# EAGLE design MODUL_LCD_V100 (EAGLE 6.4)
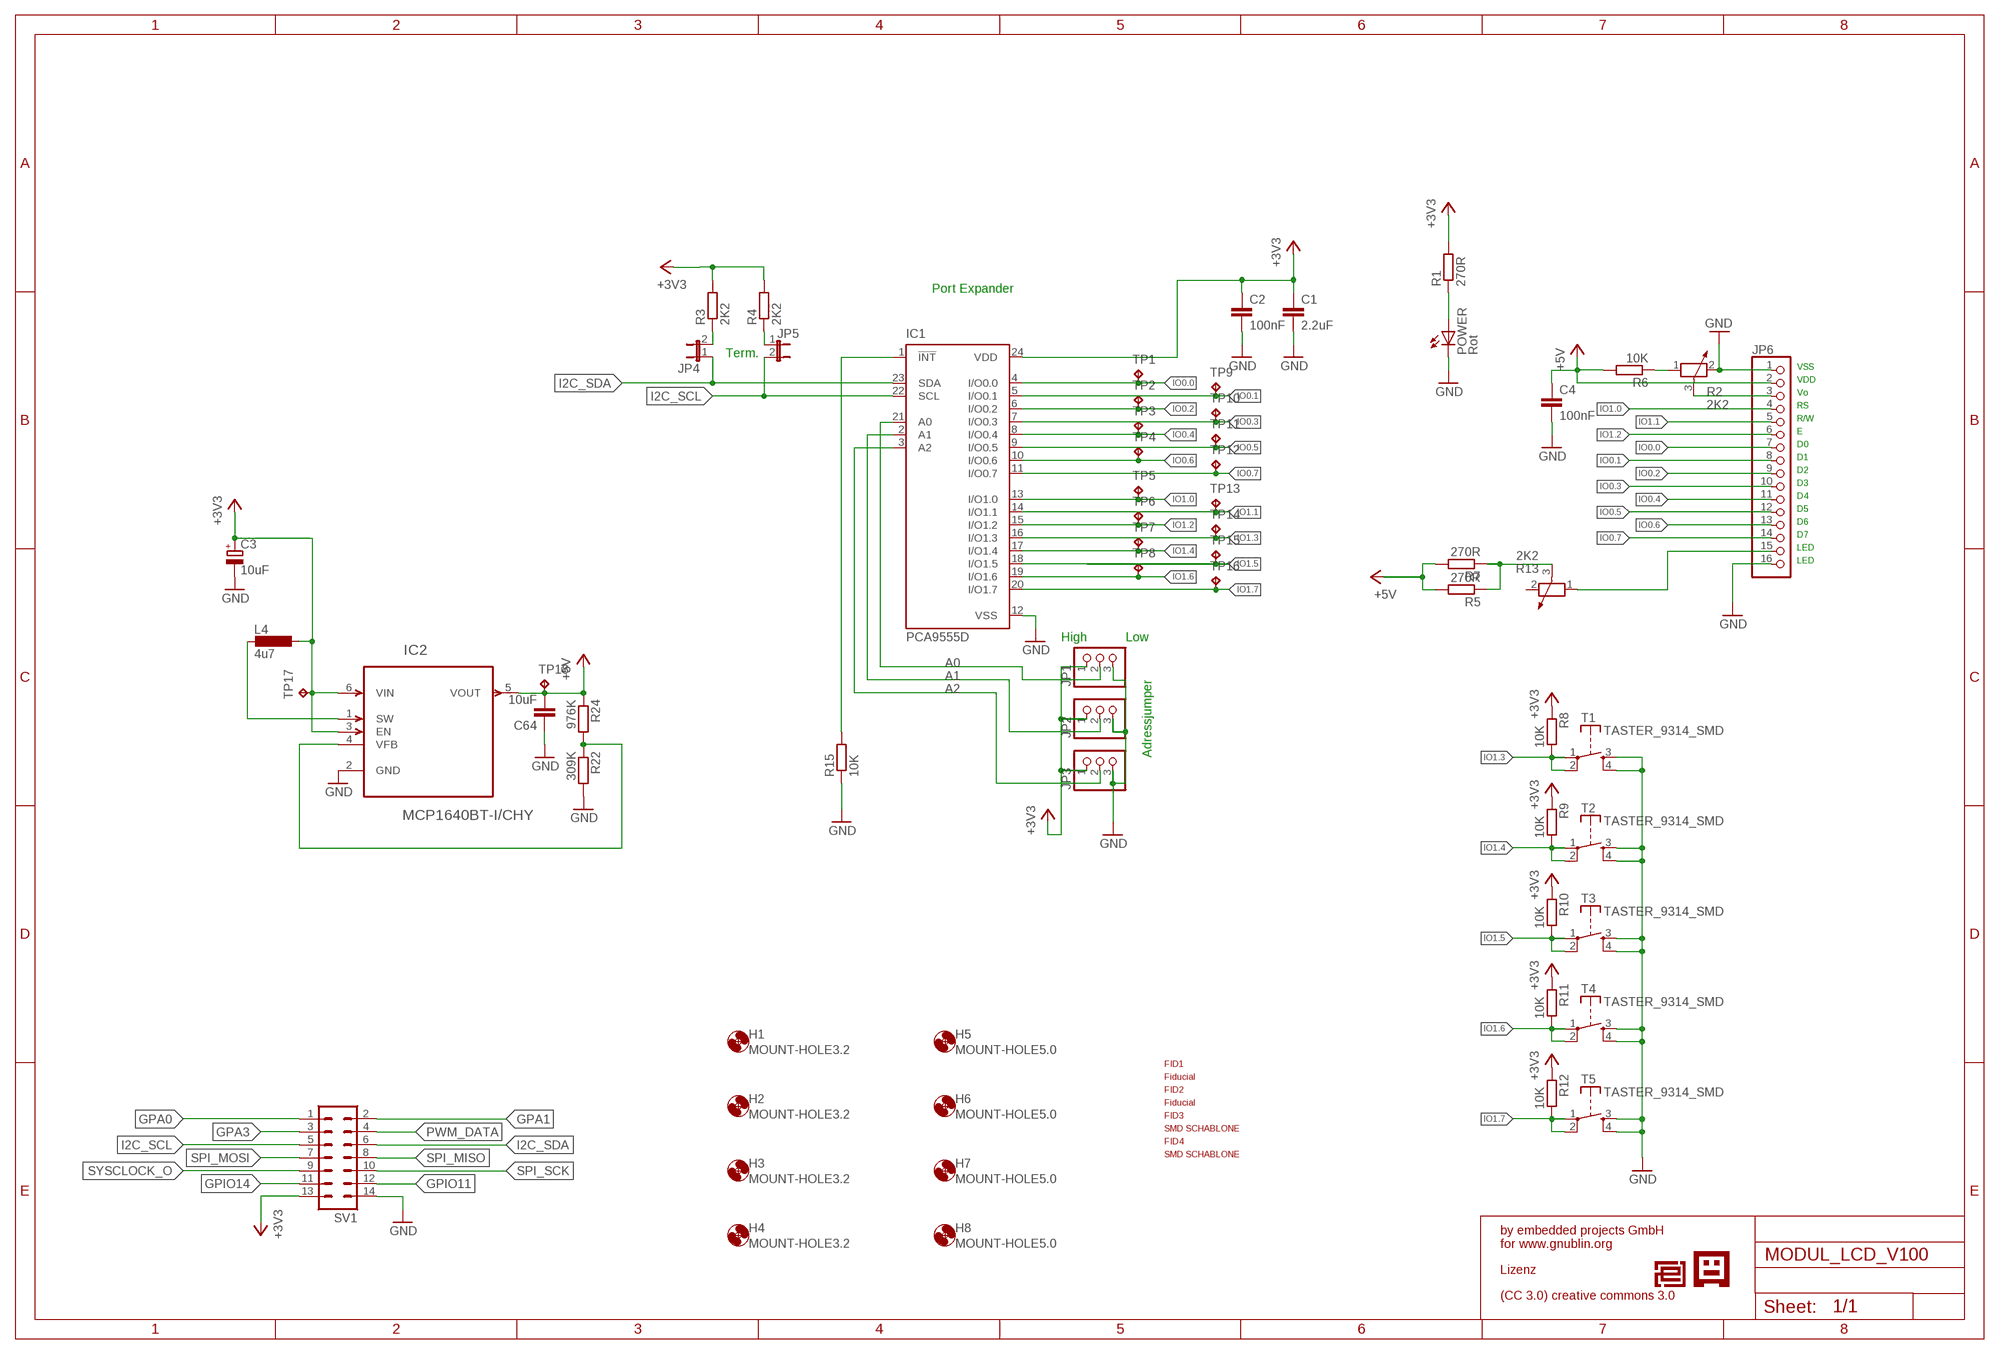
[diagram p0: schematic, sheet 1]

## Parts
C1  2.2uF  C-EUC0805  [C0805]
C2  100nF  C-EUC0805  [C0805]
C3  10uF  CPOL-EUSMCD  [SMC_D]
C4  100nF  C-EUC0805  [C0805]
C64  10uF  C-EUC0805  [C0805]
FID1  PASSERMARKEN_FIDUCIAL  [PASSERMARKEN_FIDUCIAL]
FID2  PASSERMARKEN_FIDUCIAL  [PASSERMARKEN_FIDUCIAL]
FID3  PASSERMARKEN_FIDUCIAL  [PASSERMARKEN_FIDUCIAL]
FID4  PASSERMARKEN_FIDUCIAL  [PASSERMARKEN_FIDUCIAL]
H1  MOUNT-HOLE3.2  [3,2]
H2  MOUNT-HOLE3.2  [3,2]
H3  MOUNT-HOLE3.2  [3,2]
H4  MOUNT-HOLE3.2  [3,2]
H5  MOUNT-HOLE5.0  [5,0]
H6  MOUNT-HOLE5.0  [5,0]
H7  MOUNT-HOLE5.0  [5,0]
H8  MOUNT-HOLE5.0  [5,0]
IC1  PCA9555D  [SO24]
IC2  MCP1640BT-I/CHY  [SOT95P270X145-6N]
JP1  PINHD-1X3  [1X03]
JP2  PINHD-1X3  [1X03]
JP3  PINHD-1X3  [1X03]
JP4  JP1E  [JP1]
JP5  JP1E  [JP1]
JP6  PINHD-1X16  [1X16]
L4  4u7  PSU3014  [PSU3014]
POWER  Rot  LEDCHIP-LED0805  [CHIP-LED0805]
R1  270R  R-EU_R0805  [R0805]
R2  2K2  POTENTIOMETER_PT-10  [PT-10]
R3  2K2  R-EU_R0805  [R0805]
R4  2K2  R-EU_R0805  [R0805]
R5  270R  R-EU_R0805  [R0805]
R6  10K  R-EU_R0805  [R0805]
R7  270R  R-EU_R0805  [R0805]
R8  10K  R-EU_R0805  [R0805]
R9  10K  R-EU_R0805  [R0805]
R10  10K  R-EU_R0805  [R0805]
R11  10K  R-EU_R0805  [R0805]
R12  10K  R-EU_R0805  [R0805]
R13  2K2  POTENTIOMETER_PT-10  [PT-10]
R15  10K  R-EU_R0805  [R0805]
R22  309K  R-EU_R0805  [R0805]
R24  976K  R-EU_R0805  [R0805]
SV1  ML14  [ML14]
T1  TASTER_9314_SMD  [TASTER-9314_SMD]
T2  TASTER_9314_SMD  [TASTER-9314_SMD]
T3  TASTER_9314_SMD  [TASTER-9314_SMD]
T4  TASTER_9314_SMD  [TASTER-9314_SMD]
T5  TASTER_9314_SMD  [TASTER-9314_SMD]
TP1  TPB1,27  [B1,27]
TP2  TPB1,27  [B1,27]
TP3  TPB1,27  [B1,27]
TP4  TPB1,27  [B1,27]
TP5  TPB1,27  [B1,27]
TP6  TPB1,27  [B1,27]
TP7  TPB1,27  [B1,27]
TP8  TPB1,27  [B1,27]
TP9  TPB1,27  [B1,27]
TP10  TPB1,27  [B1,27]
TP11  TPB1,27  [B1,27]
TP12  TPB1,27  [B1,27]
TP13  TPB1,27  [B1,27]
TP14  TPB1,27  [B1,27]
TP15  TPB1,27  [B1,27]
TP16  TPB1,27  [B1,27]
TP17  TPB1,27  [B1,27]
TP18  TPB1,27  [B1,27]
U$1  EPLOGOSIEB  [EPLOGOSIEBDRUCK]
U$2  GNUBLINLOGOSIEB  [GNUSIEBDRUCK]

## Nets
!INT: IC1.1(!INT) R15.2
+3V3: C1.1 C2.1 C3.+ IC1.24(VDD) IC2.3(EN) IC2.6(VIN) JP1.1 JP2.1 JP3.1 L4.2 R1.2 R3.2 R4.2 R8.1 R9.1 R10.1 R11.1 R12.1 SV1.13 TP17.TP
+5V: C4.1 C64.2 IC2.5(VOUT) JP6.2 R5.2 R6.2 R7.2 R24.1 TP18.TP
A0: IC1.21(A0) JP1.2
A1: IC1.2(A1) JP2.2
A2: IC1.3(A2) JP3.2
ENABLE_5V: IC2.1(SW) L4.1
GND: C1.2 C2.2 C3.- C4.2 C64.1 IC1.12(VSS) IC2.2(GND) JP1.3 JP2.3 JP3.3 JP6.1 JP6.16 POWER.C R2.2 R15.1 R22.2 SV1.14 T1.3(S) T1.4(S) T2.3(S) T2.4(S) T3.3(S) T3.4(S) T4.3(S) T4.4(S) T5.3(S) T5.4(S)
GPA0: SV1.1
GPA1: SV1.2
GPA3: SV1.3
GPIO11: SV1.12
GPIO14: SV1.11
I2C_SCL: IC1.22(SCL) JP5.2 SV1.5
I2C_SDA: IC1.23(SDA) JP4.1 SV1.6
IO0.0: IC1.4(I/O0.0) JP6.7 TP1.TP
IO0.1: IC1.5(I/O0.1) JP6.8 TP9.TP
IO0.2: IC1.6(I/O0.2) JP6.9 TP2.TP
IO0.3: IC1.7(I/O0.3) JP6.10 TP10.TP
IO0.4: IC1.8(I/O0.4) JP6.11 TP3.TP
IO0.5: IC1.9(I/O0.5) JP6.12 TP11.TP
IO0.6: IC1.10(I/O0.6) JP6.13 TP4.TP
IO0.7: IC1.11(I/O0.7) JP6.14 TP12.TP
IO1.0: IC1.13(I/O1.0) JP6.4 TP5.TP
IO1.1: IC1.14(I/O1.1) JP6.5 TP13.TP
IO1.2: IC1.15(I/O1.2) JP6.6 TP6.TP
IO1.3: IC1.16(I/O1.3) R8.2 T1.1(P) T1.2(P) TP14.TP
IO1.4: IC1.17(I/O1.4) R9.2 T2.1(P) T2.2(P) TP7.TP
IO1.5: IC1.18(I/O1.5) R10.2 T3.1(P) T3.2(P) TP15.TP
IO1.6: IC1.19(I/O1.6) R11.2 T4.1(P) T4.2(P) TP8.TP
IO1.7: IC1.20(I/O1.7) R12.2 T5.1(P) T5.2(P) TP16.TP
N$1: JP4.2 R3.1
N$2: POWER.A R1.1
N$3: R2.1 R6.1
N$4: JP6.15 R13.1
N$5: JP5.1 R4.1
N$6: R5.1 R7.1 R13.3
N$50: IC2.4(VFB) R22.1 R24.2
PWM_DATA: SV1.4
SPI_MISO: SV1.8
SPI_MOSI: SV1.7
SPI_SCK: SV1.10
SYSCLOCK_O: SV1.9
VO: JP6.3 R2.3
Unconnected: R13.2

## Notes on the sheet
- Port Expander
- Term.
- VSS
- VDD
- Vo
- RS
- R/W
- E
- D0
- D1
- D2
- D3
- D4
- D5
- D6
- D7
- LED
- LED
- High | Low
- Adressjumper
- by embedded projects GmbH
  for www.gnublin.org
- Lizenz
- (CC 3.0) creative commons 3.0

## Library data of the parts
C1 C2 C4 C64 = rcl:C-EU: CAPACITOR, European symbol
C3 = rcl:CPOL-EU: POLARIZED CAPACITOR, European symbol
FID1 FID2 = KUBUS3:PASSERMARKEN_FIDUCIAL: SMD Passermarke
FID3 FID4 = SMDSCHABLONE:PASSERMARKEN_FIDUCIAL: SMD Passermarke
H1-H8 = holes:MOUNT-HOLE: MOUNTING HOLE with drill center marker
IC1 = micro-philips:PCA9555: 16-bit I2C and SMBus I/O port with interrupt Source: PCA9555_5.pdf; MPN: PCA9555DW; OC_FARNELL: 8906076; OC_NEWARK: 63K6067
IC2 = mcp1640:MCP1640BT-I/CHY: Synchronous Boost Regulator; MPN: MCP1640BT-I/CHY; OC_FARNELL: 1800207; OC_NEWARK: 73R3625; PACKAGE: SOT-6; SUPPLIER: Microchip
JP1-JP3 = pinhead:PINHD-1X3: PIN HEADER
JP4 JP5 = jumper:JP1E: JUMPER
JP6 = pinhead:PINHD-1X16: PIN HEADER
L4 = KUBUS3B_PARTS2:PSU3014: SMD Power Inductors Shielded
POWER = led:LED: LED OSRAM: - CHIPLED LG R971, LG N971, LY N971, LG Q971, LY Q971, LO R971, LY R971 LH N974, LH R974 LS Q976, LO Q976, LY Q976 LO Q996 - Hyper CHIPLED LW Q18S LB Q993, LB Q99A, LB R99A - SideLED LS A670, LO A670, LY A670, LG A670, LP A670 LB A673, LV A673, LT A673, LW A673 LH A674 LY A675 LS A676, LA A676, LO A676, LY A676, LW A676 LS A679, LY A679, LG A679 - Hyper Micro SIDELED® LS Y876, LA Y876, LO Y876, LY Y876 LT Y87S - SmartLED LW L88C, LW L88S LB L89C, LB L89S, LG L890 LS L89K, LO L89K, LY L89K LS L896, LA L896, LO L896, LY L896 - TOPLED LS T670, LO T670, LY T670, LG T670, LP T670 LSG T670, LSP T670, LSY T670, LOP T670, LYG T670 LG T671, LOG T671, LSG T671 LB T673, LV T673, LT T673, LW T673 LH T674 LS T676, LA T676, LO T676, LY T676, LB T676, LH T676, LSB T676, LW T676 LB T67C, LV T67C, LT T67C, LS T67K, LO T67K, LY T67K, LW E67C LS E67B, LA E67B, LO E67B, LY E67B, LB E67C, LV E67C, LT E67C LW T67C LS T679, LY T679, LG T679 LS T770, LO T770, LY T770, LG T770, LP T770 LB T773, LV T773, LT T773, LW T773 LH T774 LS E675, LA E675, LY E675, LS T675 LS T776, LA T776, LO T776, LY T776, LB T776 LHGB T686 LT T68C, LB T68C - Hyper Mini TOPLED® LB M676 - Mini TOPLED Santana® LG M470 LS M47K, LO M47K, LY M47K Source: http://www.osram.convergy.de LUXEON: - LUMILED® LXK2-PW12-R00, LXK2-PW12-S00, LXK2-PW14-U00, LXK2-PW14-V00 LXK2-PM12-R00, LXK2-PM12-S00, LXK2-PM14-U00 LXK2-PE12-Q00, LXK2-PE12-R00, LXK2-PE12-S00, LXK2-PE14-T00, LXK2-PE14-U00 LXK2-PB12-K00, LXK2-PB12-L00, LXK2-PB12-M00, LXK2-PB14-N00, LXK2-PB14-P00, LXK2-PB14-Q00 LXK2-PR12-L00, LXK2-PR12-M00, LXK2-PR14-Q00, LXK2-PR14-R00 LXK2-PD12-Q00, LXK2-PD12-R00, LXK2-PD12-S00 LXK2-PH12-R00, LXK2-PH12-S00 LXK2-PL12-P00, LXK2-PL12-Q00, LXK2-PL12-R00 Source: www.luxeon.com KINGBRIGHT: KA-3528ASYC Source: www.kingbright.com
R1 R3-R12 R15 R22 R24 = rcl:R-EU_: RESISTOR, European symbol
R2 R13 = rcl:POTENTIOMETER_: Potentiometer
SV1 = con-ml:ML14: HARTING; OC_FARNELL: unknown; OC_NEWARK: unknown
T1-T5 = Ergaenzung:TASTER_9314_SMD
TP1-TP18 = testpad:TP: Test pad
U$1 = EmbeddedProjectsLogos2:EPLOGO
U$2 = EmbeddedProjectsLogos2:GNUBLINLOGO

## Net classes
2 5V: width 0.2 mm, clearance 0.15 mm

## Board
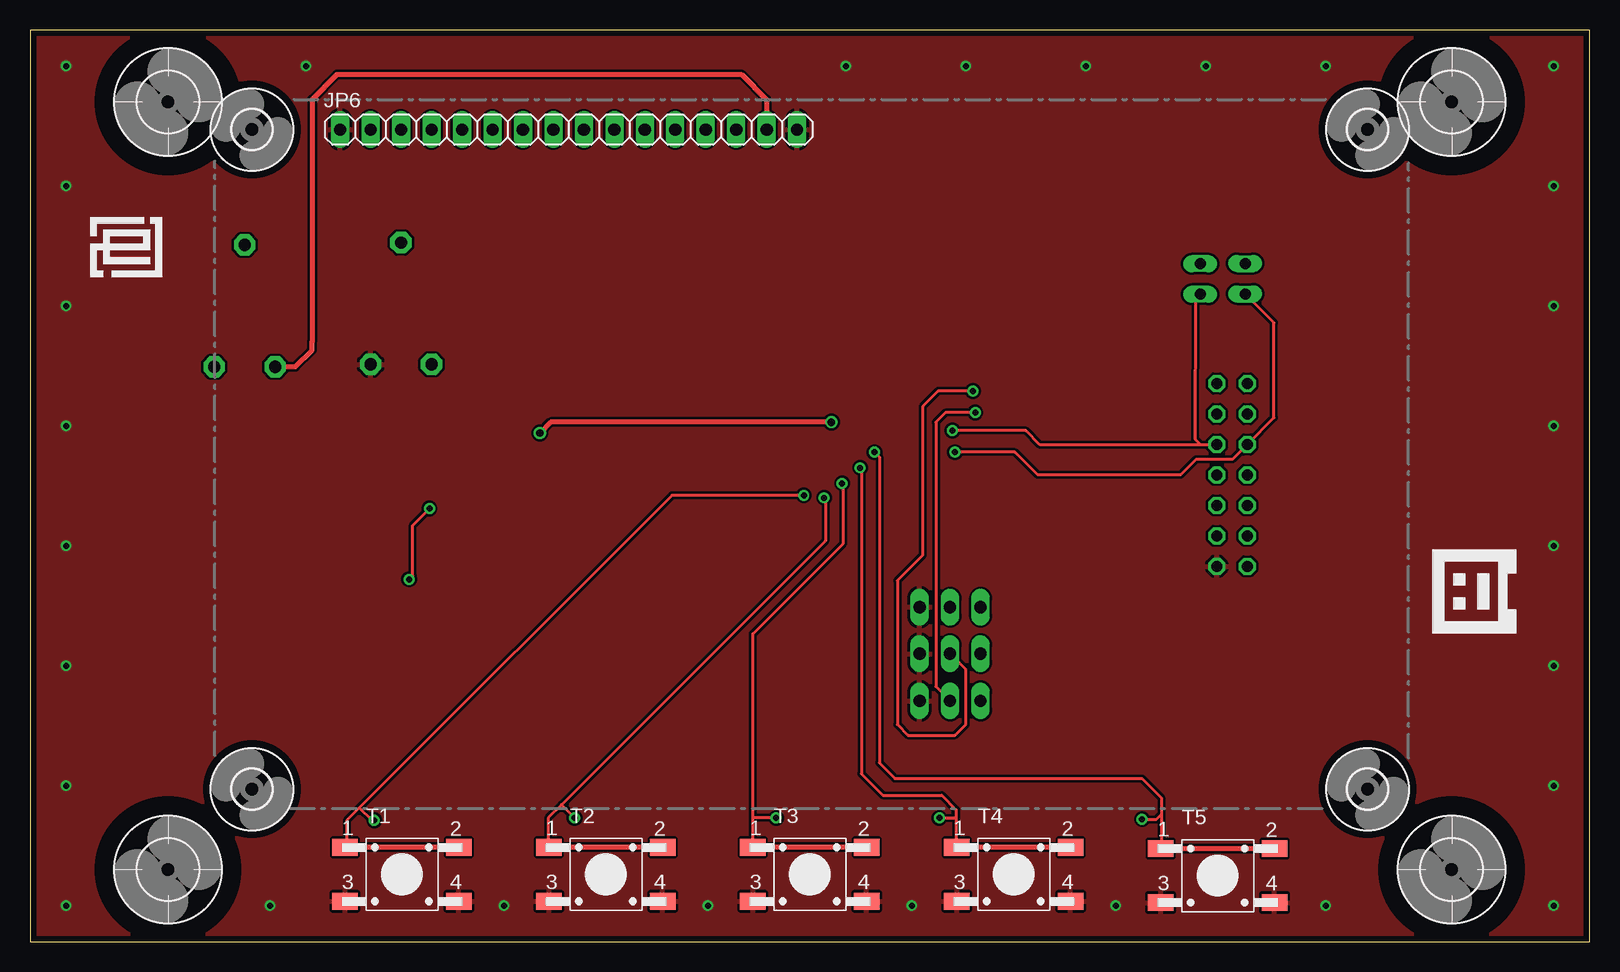
[diagram p1: board, top side]
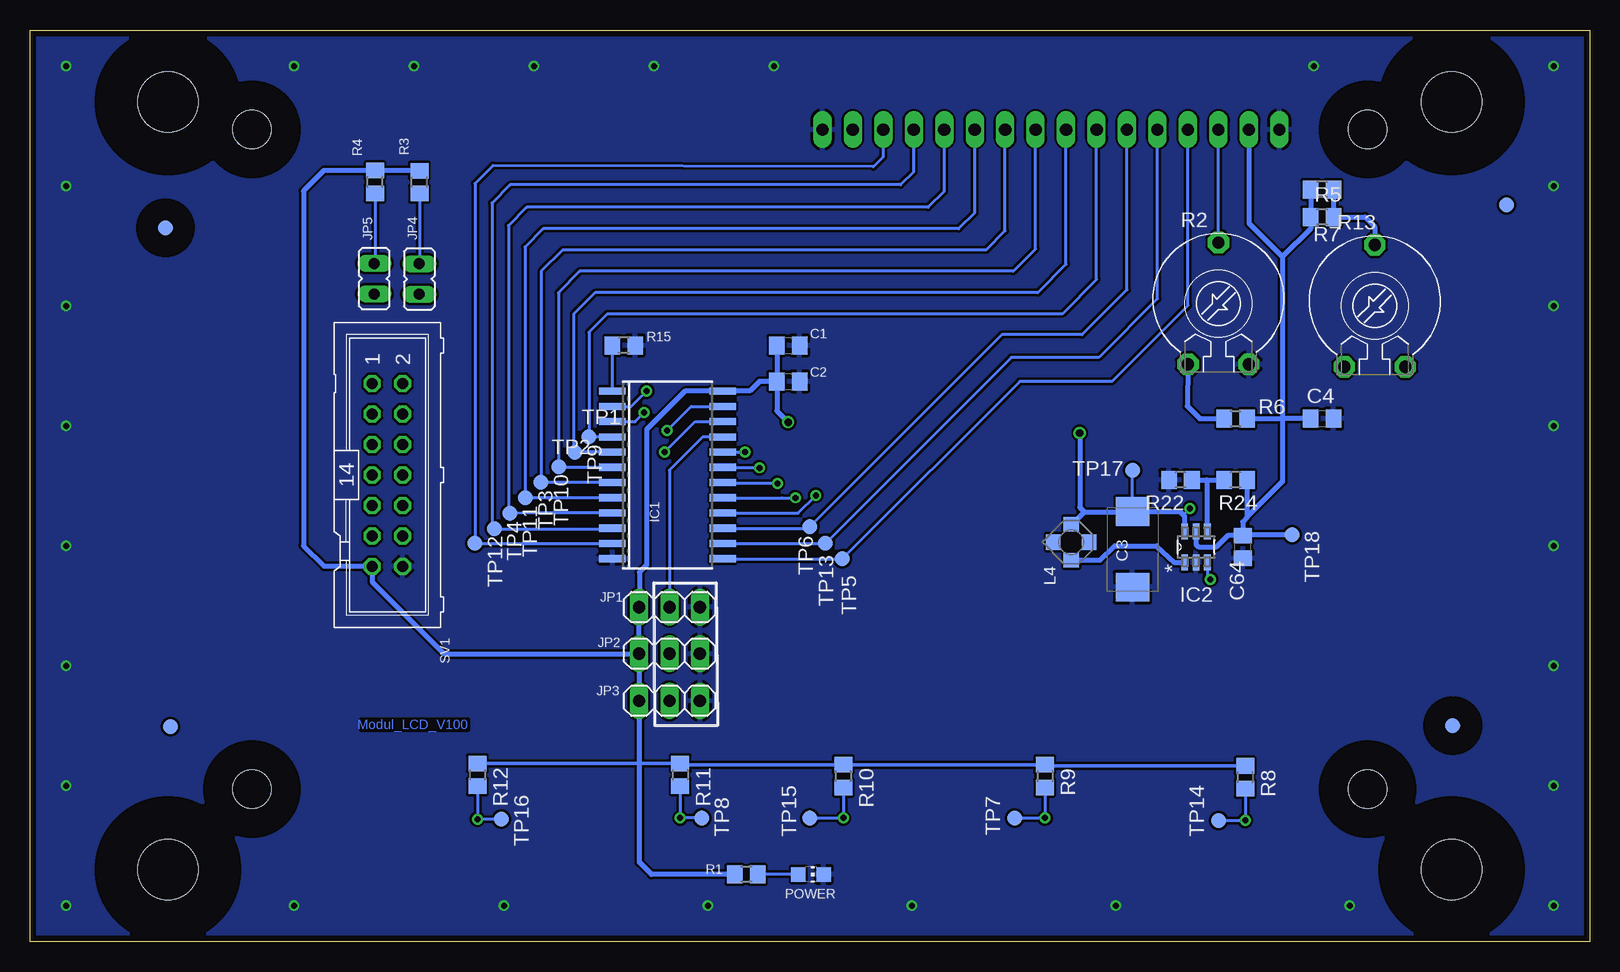
[diagram p2: board, bottom side, seen from below]

Size 130 x 76 mm. Coordinates in mm from the lower left corner, seen from the top.
Outline: 0,76 0,0 130,0 130,76 0,76
Copper layers (1*16): Top 0.035mm / dielectric 1.5mm / Bottom 0.035mm
Design rules "default *": minimum track width 10mil, minimum drill 24mil, track to track 8mil, track to pad 8mil, pad to pad 8mil, via to via 8mil, smd to smd 8mil, copper to edge 20mil, drill to drill 8mil, minimum pad ring 10mil, minimum via ring 8mil, stop-mask expansion 4mil, vias tented up to drill 40mil, thermal gap 10mil

### Footprints (pad centres in the part's own frame; a part is rotated, then mirrored left to right if it is on the bottom)
C0805 = smd 1.3 x 1.5: 1 -0.95,0; 2 0.95,0
SMC_D = smd 2.4 x 2.8: + -3.15,0; - 3.15,0
PASSERMARKEN_FIDUCIAL = smd 1.27 x 1.27: 1 0,0
3,2 = hole 3.2: 0,0
5,0 = hole 5: 0,0
SO24 = smd 0.6 x 2.2: 1 -6.985,-4.6; 2 -5.715,-4.6; 3 -4.445,-4.6; 4 -3.175,-4.6; 5 -1.905,-4.6; 6 -0.635,-4.6; 7 0.635,-4.6; 8 1.905,-4.6; 9 3.175,-4.6; 10 4.445,-4.6; 11 5.715,-4.6; 12 6.985,-4.6; 13 6.985,4.6; 14 5.715,4.6; 15 4.445,4.6; 16 3.175,4.6; 17 1.905,4.6; 18 0.635,4.6; 19 -0.635,4.6; 20 -1.905,4.6; 21 -3.175,4.6; 22 -4.445,4.6; 23 -5.715,4.6; 24 -6.985,4.6
SOT95P270X145-6N = smd 1.321 x 0.559: 1 -1.295,0.94; 2 -1.295,0; 3 -1.295,-0.94; 4 1.295,-0.94; 5 1.295,0; 6 1.295,0.94
1X03 = drill 1.016 long: 1 -2.54,0; 2 0,0; 3 2.54,0
JP1 = drill 0.914 long: 1 0,-1.27; 2 0,1.27
1X16 = drill 1.016 long: 1 -19.05,0; 2 -16.51,0; 3 -13.97,0; 4 -11.43,0; 5 -8.89,0; 6 -6.35,0; 7 -3.81,0; 8 -1.27,0; 9 1.27,0; 10 3.81,0; 11 6.35,0; 12 8.89,0; 13 11.43,0; 14 13.97,0; 15 16.51,0; 16 19.05,0
PSU3014 = smd 1.2 x 1.3: 1 -1.5,0; 2 1.5,0 | smd 1.3 x 1.2: 3 0,1.5; 4 0,-1.5
CHIP-LED0805 = smd 1.2 x 1.2: A 0,-1.05; C 0,1.05
R0805 = smd 1.3 x 1.5: 1 -0.95,0; 2 0.95,0
PT-10 = drill 1.016 pad 1.778 octagon: 1 -2.54,-5.08; 2 2.54,-5.08; 3 0,5.08
ML14 = drill 0.914 octagon: 1 -7.62,-1.27; 2 -7.62,1.27; 3 -5.08,-1.27; 4 -5.08,1.27; 5 -2.54,-1.27; 6 -2.54,1.27; 7 0,-1.27; 8 0,1.27; 9 2.54,-1.27; 10 2.54,1.27; 11 5.08,-1.27; 12 5.08,1.27; 13 7.62,-1.27; 14 7.62,1.27
TASTER-9314_SMD = smd 2.1 x 1.4: 1 -4.746,2.25; 2 4.746,2.25; 3 -4.746,-2.25; 4 4.746,-2.25
B1,27 = smd 1.27 x 1.27: TP 0,0

### Placement (x,y rotation side)
C1  66.8,49.7 0 bottom
C2  66.8,46.7 0 bottom
C3  38.1,32.7 270 bottom
C4  22.3,43.6 0 bottom
C64  28.9,32.9 90 bottom
FID1  11.4,18 180 bottom
FID2  118.7,59.5 0 bottom
FID3  118.3,17.9 0 bottom
FID4  6.9,61.4 0 bottom
H1  18.5,67.7 270 top
H2  18.5,12.7 270 top
H3  111.5,12.7 270 top
H4  111.5,67.7 270 top
H5  11.5,6 0 top
H6  118.5,6 0 top
H7  118.5,70 0 top
H8  11.5,70 0 top
IC1  76.85,38.9 270 bottom
IC2  32.8,32.9 90 bottom
JP1  76.7,27.88 0 bottom
JP2  76.7,24 0 bottom
JP3  76.7,20.07 0 bottom
JP4  97.55,55.24 0 bottom
JP5  101.3,55.26 180 bottom
JP6  44.9,67.7 0 top
L4  43.2,33.3 90 bottom
POWER  64.9,5.6 270 bottom
R1  70.3,5.6 180 bottom
R2  30.93,53.2 0 bottom
R3  97.54,63.31 90 bottom
R4  101.24,63.33 90 bottom
R5  22.3,60.4 180 bottom
R6  29.5,43.6 0 bottom
R7  22.3,62.7 180 bottom
R8  28.7,13.7 270 bottom
R9  45.4,13.8 270 bottom
R10  62.2,13.8 270 bottom
R11  75.8,13.9 270 bottom
R12  92.7,13.9 270 bottom
R13  17.9,53 0 bottom
R15  80.5,49.7 180 bottom
R22  34.1,38.5 180 bottom
R24  29.5,38.5 180 bottom
SV1  100.2,38.9 270 bottom
T1  31,5.6 0 top
T2  48,5.6 0 top
T3  65,5.6 0 top
T4  82,5.6 0 top
T5  99,5.5 0 top
TP1  83.4,42.1 0 bottom
TP2  85.9,39.6 0 bottom
TP3  88.7,37 270 bottom
TP4  91.3,34.4 270 bottom
TP5  62.3,31.9 270 bottom
TP6  65,34.6 270 bottom
TP7  47.9,10.3 270 bottom
TP8  74,10.3 270 bottom
TP9  84.6,40.8 270 bottom
TP10  87.4,38.3 270 bottom
TP11  90,35.7 270 bottom
TP12  92.9,33.2 270 bottom
TP13  63.7,33.2 270 bottom
TP14  30.9,10.1 270 bottom
TP15  65,10.3 270 bottom
TP16  90.7,10.2 270 bottom
TP17  38.1,39.3 0 bottom
TP18  24.8,33.9 270 bottom
U$1  5,55.4 0 top
U$2  123.9,25.7 90 top

### Tracks (layer width: path | path; a pad name or v marks a point on that pad's centre or on a via)
!INT
  Bottom 0.254: IC1.1 R15.2
+3V3  (via drill 0.5, 0.6)
  Top 0.254: v31.6,30.2 31.9,30.5 31.9,34.7 v33.3,36.1
  Top 0.406: v66.8,43.3 43.4,43.3 v42.5,42.4
  Bottom 0.254: IC2.3 31.86,30.46 v31.6,30.2 | v33.3,36.1 33.85,35.55 | 79.2,20.03 JP3.1 | 101.49,31.3 SV1.13 | 101.22,64.26 R4.2 | C3.+ TP17.TP
  Bottom 0.305: 72.23,45.9 IC1.24 | 79.2,27.92 JP1.1 | R8.1 45.3,14.65 R9.1 R10.1 75.7,14.75 R11.1 79.05,14.85 79.2,14.7 | R12.1 79.25,14.85 79.2,15
  Bottom 0.406: SV1.13 101.47,29.97 95.5,24 JP2.1 | JP2.1 JP1.1 | JP2.1 JP3.1 | L4.2 43.1,34.8 42.1,35.8 | IC2.6 33.74,35.44 33.85,35.55 34.1,35.8 37.5,35.8 C3.+ 38.7,35.8 42.1,35.8 | R1.2 78.2,5.6 79.2,6.6 79.2,14.7 79.2,15 79.2,20.03 | C1.1 C2.1 | C2.1 69.2,46.7 70,45.9 72.23,45.9 | IC1.24 75.42,45.88 78.6,42.7 78.6,31.4 79.2,30.8 79.2,27.92 | R4.2 105.52,64.28 107.2,62.6 107.2,33 105.5,31.3 101.49,31.3 | R3.2 101.22,64.26 | C2.1 67.75,44.25 v66.8,43.3 | v42.5,42.4 42.5,36.2 42.1,35.8
+5V
  Bottom 0.406: TP18.TP 28.85,33.9 C64.2 | IC2.5 32.8,33.1 32.6,32.9 31.1,32.9 30.15,33.85 C64.2 | R24.1 28.55,35.4 | 28.55,35.4 28.55,35.35 28.9,35 C64.2 | 25.6,43.6 25.6,38.35 28.55,35.4 | R6.2 25.7,43.6 25.6,43.6 | C4.1 25.6,43.6 | JP6.2 28.39,59.89 25.6,57.1 | 25.6,57.1 25.6,43.9 25.6,43.6 | R7.2 R5.2 23.25,59.45 25.6,57.1
A0
  Bottom 0.254: IC1.21 73.92,42.08 76.7,39.3 JP1.2
A1  (via drill 0.5)
  Top 0.254: v78.6,45.9 75.7,45.9 74.4,44.6 74.4,32.2 72.3,30.1 72.3,18.1 73.2,17.2 77.1,17.2 78,18.1 78,22.7 JP2.2
  Bottom 0.254: IC1.2 79.89,44.62 v78.6,45.9
A2  (via drill 0.5)
  Top 0.254: v78.8,44.1 76.3,44.1 75.5,43.3 75.5,21.27 JP3.2
  Bottom 0.254: IC1.3 79.56,43.34 v78.8,44.1
ENABLE_5V
  Bottom 0.406: L4.1 40.8,31.8 39.6,33 36.1,33 34.6,31.6 IC2.1
GND  (via drill 0.5)
  other vias: 3,3 3,13 3,23 3,33 3,43 3,53 3,63 3,73 127,3 127,13 127,23 127,33 127,43 127,53 127,63 127,73 20,3 39.5,3 56.5,3 73.5,3 90.5,3 108,3 108,73 98,73 88,73 78,73 68,73 23,73
  pour Bottom: -8.7,79.7 -8.4,-2.7 134.8,-2.7 134.7,78.8
  pour Top: -8.3,79.1 -8.5,-2.4 136.9,-2.5 136.3,79.1
I2C_SCL  (via drill 0.5)
  Top 0.254: v77.1,40.8 82.1,40.8 84,38.9 95.9,38.9 97.2,40.2 100.23,40.2 SV1.5 103.7,43.67 103.7,51.6 JP5.2
  Bottom 0.254: IC1.22 74.56,43.34 v77.1,40.8
I2C_SDA  (via drill 0.5)
  Top 0.254: 97.6,41.4 98.77,41.4 SV1.6 | 97.6,41.4 84.2,41.4 83,42.6 v76.9,42.6 | 97.6,41.4 97.15,41.85 97.2,53.6 97.2,53.62 JP4.1
  Bottom 0.254: IC1.23 74.89,44.62 v76.9,42.6
IO0.0
  Bottom 0.254: IC1.4 83.08,42.08 TP1.TP 83.41,42.19 83.41,50.8 81.89,52.32 43.96,52.32 41.09,55.19 JP6.7
IO0.1
  Bottom 0.254: IC1.5 84.2,40.8 TP9.TP 84.68,40.82 84.68,52.32 82.9,54.1 45.99,54.1 43.63,56.46 JP6.8
IO0.2
  Bottom 0.254: IC1.6 85.83,39.53 TP2.TP 85.95,39.75 85.95,54.1 84.17,55.88 48.02,55.88 46.17,57.73 JP6.9
IO0.3
  Bottom 0.254: IC1.7 87.27,38.27 TP10.TP 87.38,38.32 87.38,55.88 85.6,57.66 50.31,57.66 48.71,59.26 JP6.10
IO0.4
  Bottom 0.254: IC1.8 88.59,36.99 TP3.TP 88.75,37.05 88.75,57.91 87.22,59.44 52.59,59.44 51.25,60.78 JP6.11
IO0.5
  Bottom 0.254: IC1.9 87.47,35.73 TP11.TP 90.12,35.78 90.12,59.69 88.59,61.21 55.13,61.21 53.79,62.56 JP6.12
IO0.6
  Bottom 0.254: IC1.10 81.5,34.4 TP4.TP 91.49,34.61 91.49,61.57 89.96,63.09 57.42,63.09 56.33,64.18 JP6.13
IO0.7
  Bottom 0.254: IC1.11 81.47,33.2 TP12.TP 92.9,63.2 91.4,64.7 59.7,64.6 58.87,65.43 JP6.14
IO1.0
  Bottom 0.254: IC1.13 62.72,31.91 TP5.TP 47.5,46.7 39.8,46.7 33.47,53.03 JP6.4
IO1.1
  Bottom 0.254: IC1.14 63.72,33.19 TP13.TP 48.2,48.7 40.9,48.7 36.01,53.59 JP6.5
IO1.2
  Bottom 0.254: IC1.15 65.14,34.45 TP6.TP 49,50.6 42.3,50.6 38.55,54.35 JP6.6
IO1.3  (via drill 0.5)
  Top 0.254: v64.5,37.2 53.5,37.2 27.45,11.15 | 27.45,11.15 26.4,10.1 26.4,8 T1.1 | v28.7,10.1 28.5,10.1 27.45,11.15
  Top 0.406: T1.2 T1.1
  Bottom 0.254: IC1.16 65.97,35.73 v64.5,37.2 | TP14.TP v28.7,10.1 R8.2
IO1.4  (via drill 0.5)
  Top 0.254: v66.2,37 66.3,36.9 66.3,33.4 44.3,11.4 | 44.3,11.4 43.2,10.3 43.2,7.9 T2.1 | v45.4,10.3 44.8,10.9 44.3,11.4
  Top 0.406: T2.2 T2.1
  Bottom 0.254: IC1.17 67.31,36.99 v66.2,37 | TP7.TP v45.4,10.3 R9.2
IO1.5  (via drill 0.5)
  Top 0.254: T3.1 60.25,10.3 | 60.25,10.3 60.25,25.65 67.8,33.2 67.8,38.1 v67.7,38.2 | v62.2,10.3 60.25,10.3
  Top 0.406: T3.2 T3.1
  Bottom 0.254: v67.7,38.2 72.19,38.2 IC1.18 | TP15.TP v62.2,10.3 R10.2
IO1.6  (via drill 0.5)
  Top 0.254: v69.2,39.5 69.3,39.4 69.3,14 71.1,12.2 76,12.2 77.2,11 77.2,10.3 | 77.2,10.3 77.2,7.9 T4.1 | v75.8,10.3 77.2,10.3
  Top 0.406: T4.2 T4.1
  Bottom 0.254: IC1.19 69.44,39.53 v69.2,39.5 | TP8.TP v75.8,10.3 R11.2
IO1.7  (via drill 0.5)
  Top 0.254: v70.4,40.8 70.8,40.4 70.8,14.9 72.1,13.6 92.7,13.6 94.3,12 94.3,10.6 | 94.3,10.6 94.3,7.8 T5.1 | v92.7,10.2 93.9,10.2 94.3,10.6
  Top 0.406: T5.2 T5.1
  Bottom 0.254: IC1.20 70.7,40.8 v70.4,40.8 | TP16.TP v92.7,10.2 R12.2
N$1
  Bottom 0.254: R3.1 JP4.2
N$2
  Bottom 0.254: POWER.A R1.1
N$3
  Bottom 0.406: R2.1 33.54,44.64 32.5,43.6 R6.1
N$4
  Top 0.406: JP6.15 61.4,70.2 59.3,72.3 25.6,72.3 23.5,70.2 23.5,49.98 23.5,49.3 22.12,47.92 R13.1
N$5
  Bottom 0.254: R4.1 101.24,56.59 JP5.1
N$6
  Bottom 0.406: R7.1 R5.1 18.7,60.4 17.9,59.6 R13.3
N$50
  Bottom 0.406: R22.1 31.9,38.5 | 31.9,38.5 R24.2 | IC2.4 31.86,38.46 31.9,38.5
VO
  Bottom 0.254: R2.3 JP6.3

### Text on the board
Bottom: Modul_LCD_V100
tDocu: Display | www.gnublin.org | Modul LCD V1.00 | T1 | T2 | T3 | T4 | T5
bDocu: SDA | SCL | I2C-Pullups | GNUBLIN | A0 | A1 | A2 | Low | High